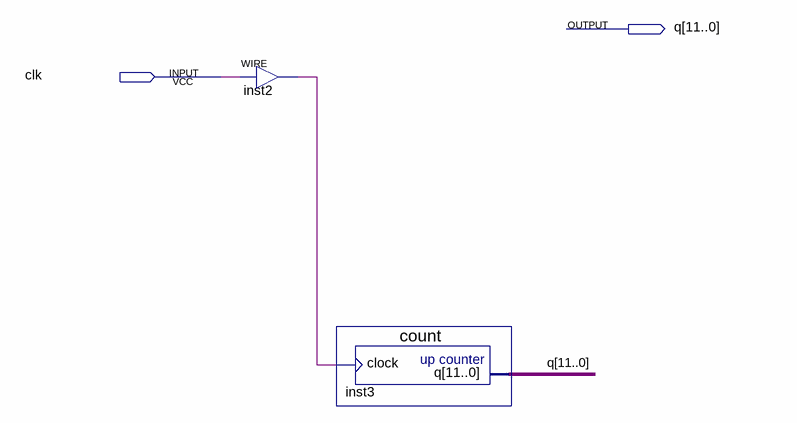
[diagram p0: schematic sheet]
// Quartus schematic test1.bdf as structural Verilog: 2 symbols, 2 pins
module test1 (
  input  clk,
  output [11:0] q
);

  wire inst2_out;

  assign inst2_out = clk;  // WIRE inst2
  count inst3 (.clock(inst2_out), .q(q));
endmodule
